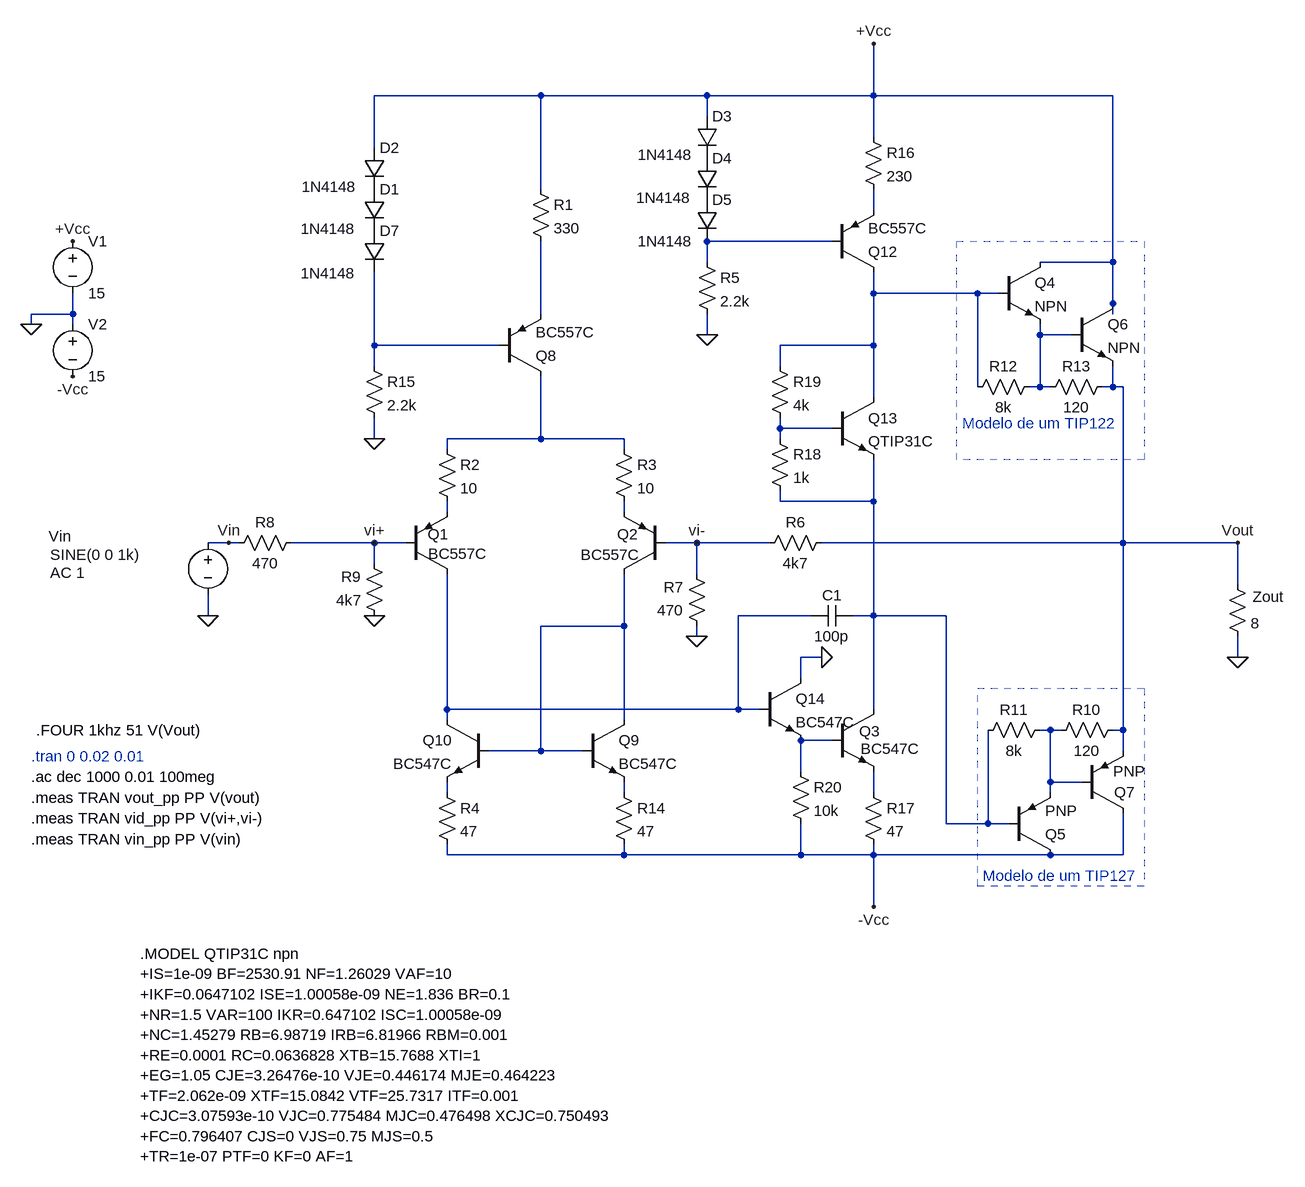
[diagram p0: schematic Amp_v2.asc]
Amp_v2.asc, the LTspice schematic file:
Version 4.1
SHEET 1 2292 1108
WIRE 112 -528 -144 -528
WIRE 368 -528 112 -528
WIRE 624 -528 624 -608
WIRE 624 -528 368 -528
WIRE 992 -528 624 -528
WIRE 368 -496 368 -528
WIRE 624 -464 624 -528
WIRE -144 -448 -144 -528
WIRE 112 -384 112 -528
WIRE 624 -352 624 -384
WIRE 560 -304 368 -304
WIRE 368 -272 368 -304
WIRE 992 -272 992 -528
WIRE 992 -272 880 -272
WIRE 624 -224 624 -256
WIRE 784 -224 624 -224
WIRE 816 -224 784 -224
WIRE 992 -208 992 -272
WIRE -608 -192 -608 -224
WIRE -608 -192 -672 -192
WIRE 112 -192 112 -304
WIRE 992 -192 992 -208
WIRE -672 -176 -672 -192
WIRE -608 -176 -608 -192
WIRE 368 -160 368 -192
WIRE 880 -160 880 -176
WIRE 928 -160 880 -160
WIRE -144 -144 -144 -256
WIRE 48 -144 -144 -144
WIRE 624 -144 624 -224
WIRE 624 -144 480 -144
WIRE -144 -112 -144 -144
WIRE 480 -112 480 -144
WIRE 784 -80 784 -224
WIRE 880 -80 880 -160
WIRE 880 -80 864 -80
WIRE 896 -80 880 -80
WIRE 992 -80 992 -112
WIRE 992 -80 976 -80
WIRE 1008 -80 992 -80
WIRE 624 -64 624 -144
WIRE 480 -16 480 -32
WIRE 560 -16 480 -16
WIRE -144 0 -144 -32
WIRE 112 0 112 -96
WIRE 112 0 -32 0
WIRE 240 0 112 0
WIRE 480 0 480 -16
WIRE -32 16 -32 0
WIRE 240 16 240 0
WIRE 480 96 480 80
WIRE 624 96 624 32
WIRE 624 96 480 96
WIRE -32 112 -32 96
WIRE 240 112 240 96
WIRE -368 160 -400 160
WIRE -352 160 -368 160
WIRE -144 160 -272 160
WIRE -96 160 -144 160
WIRE 352 160 304 160
WIRE 464 160 352 160
WIRE 1008 160 1008 -80
WIRE 1008 160 544 160
WIRE 1184 160 1008 160
WIRE -144 192 -144 160
WIRE 352 208 352 160
WIRE 1184 224 1184 160
WIRE -400 272 -400 240
WIRE 528 272 416 272
WIRE 624 272 624 96
WIRE 624 272 592 272
WIRE 736 272 624 272
WIRE 240 288 240 208
WIRE 240 288 112 288
WIRE 352 304 352 288
WIRE 544 336 512 336
WIRE 1184 336 1184 304
WIRE 512 368 512 336
WIRE -32 416 -32 208
WIRE 416 416 416 272
WIRE 416 416 -32 416
WIRE 448 416 416 416
WIRE 624 416 624 272
WIRE -32 432 -32 416
WIRE 240 432 240 288
WIRE 896 448 880 448
WIRE 912 448 896 448
WIRE 1008 448 1008 160
WIRE 1008 448 992 448
WIRE 560 464 512 464
WIRE 112 480 112 288
WIRE 112 480 32 480
WIRE 176 480 112 480
WIRE 1008 480 1008 448
WIRE 512 512 512 464
WIRE 896 528 896 448
WIRE 944 528 896 528
WIRE -32 544 -32 528
WIRE 240 544 240 528
WIRE 624 544 624 512
WIRE 896 544 896 528
WIRE 736 592 736 272
WIRE 800 592 800 448
WIRE 800 592 736 592
WIRE 832 592 800 592
WIRE -32 640 -32 624
WIRE 240 640 240 624
WIRE 240 640 -32 640
WIRE 512 640 512 592
WIRE 512 640 240 640
WIRE 624 640 624 624
WIRE 624 640 512 640
WIRE 896 640 624 640
WIRE 1008 640 1008 576
WIRE 1008 640 896 640
WIRE 624 720 624 640
FLAG -400 272 0
FLAG -672 -176 0
FLAG -608 -304 +Vcc
FLAG 624 -608 +Vcc
FLAG -608 -96 -Vcc
FLAG 624 720 -Vcc
FLAG -144 272 0
FLAG 1184 160 Vout
FLAG 1184 336 0
FLAG -144 0 0
FLAG 368 -160 0
FLAG 544 336 0
FLAG -144 160 vi+
FLAG 352 160 vi-
FLAG -368 160 Vin
FLAG 352 304 0
SYMBOL voltage -608 -320 R0
WINDOW 123 24 44 Left 2
WINDOW 39 0 0 Left 0
SYMATTR InstName V1
SYMATTR Value 15
SYMBOL voltage -608 -192 R0
WINDOW 123 0 0 Left 0
WINDOW 39 0 0 Left 0
SYMATTR InstName V2
SYMATTR Value 15
SYMBOL voltage -400 144 R0
WINDOW 123 -243 62 Left 2
WINDOW 39 24 152 Left 0
WINDOW 0 -245 6 Left 2
WINDOW 3 -243 34 Left 2
SYMATTR Value2 AC 1
SYMATTR InstName Vin
SYMATTR Value SINE(0 0 1k)
SYMBOL res -48 0 R0
SYMATTR InstName R2
SYMATTR Value 10
SYMBOL res 224 0 R0
SYMATTR InstName R3
SYMATTR Value 10
SYMBOL res 560 144 R90
WINDOW 0 0 56 VBottom 2
WINDOW 3 32 56 VTop 2
SYMATTR InstName R6
SYMATTR Value 4k7
SYMBOL res 368 304 R180
WINDOW 0 36 76 Left 2
WINDOW 3 36 40 Left 2
SYMATTR InstName R7
SYMATTR Value 470
SYMBOL res 1008 432 R90
WINDOW 0 0 56 VBottom 2
WINDOW 3 32 56 VTop 2
SYMATTR InstName R10
SYMATTR Value 120
SYMBOL res 896 432 R90
WINDOW 0 0 56 VBottom 2
WINDOW 3 32 56 VTop 2
SYMATTR InstName R11
SYMATTR Value 8k
SYMBOL res 880 -96 R90
WINDOW 0 0 56 VBottom 2
WINDOW 3 32 56 VTop 2
SYMATTR InstName R12
SYMATTR Value 8k
SYMBOL res 992 -96 R90
WINDOW 0 0 56 VBottom 2
WINDOW 3 32 56 VTop 2
SYMATTR InstName R13
SYMATTR Value 120
SYMBOL cap 592 256 R90
WINDOW 0 0 32 VBottom 2
WINDOW 3 32 32 VTop 2
SYMATTR InstName C1
SYMATTR Value 100p
SYMBOL npn 560 416 R0
WINDOW 0 42 34 Left 2
WINDOW 3 44 61 Left 2
SYMATTR InstName Q3
SYMATTR Value BC547C
SYMBOL npn 816 -272 R0
SYMATTR InstName Q4
SYMBOL pnp 832 640 M180
SYMATTR InstName Q5
SYMBOL npn 928 -208 R0
SYMATTR InstName Q6
SYMBOL pnp 944 576 M180
WINDOW 0 50 32 Left 2
WINDOW 3 49 65 Left 2
SYMATTR InstName Q7
SYMBOL pnp -96 208 M180
WINDOW 0 34 61 Left 2
WINDOW 3 35 31 Left 2
SYMATTR InstName Q1
SYMATTR Value BC557C
SYMBOL pnp 304 208 R180
WINDOW 0 42 61 Left 2
WINDOW 3 40 30 Left 2
SYMATTR InstName Q2
SYMATTR Value BC557C
SYMBOL res -256 144 R90
WINDOW 0 0 56 VBottom 2
WINDOW 3 32 56 VTop 2
SYMATTR InstName R8
SYMATTR Value 470
SYMBOL res -128 288 R180
WINDOW 0 36 76 Left 2
WINDOW 3 36 40 Left 2
SYMATTR InstName R9
SYMATTR Value 4k7
SYMBOL res 1168 208 R0
WINDOW 0 39 35 Left 2
SYMATTR InstName Zout
SYMATTR Value 8
SYMBOL res -160 -128 R0
SYMATTR InstName R15
SYMATTR Value 2.2k
SYMBOL res 96 -400 R0
SYMATTR InstName R1
SYMATTR Value 330
SYMBOL pnp 48 -96 M180
SYMATTR InstName Q8
SYMATTR Value BC557C
SYMBOL diode -160 -320 R0
WINDOW 3 -97 65 Left 2
SYMATTR Value 1N4148
SYMATTR InstName D7
SYMBOL npn 176 432 R0
SYMATTR InstName Q9
SYMATTR Value BC547C
SYMBOL npn 32 432 M0
SYMATTR InstName Q10
SYMATTR Value BC547C
SYMBOL res -48 528 R0
SYMATTR InstName R4
SYMATTR Value 47
SYMBOL res 224 528 R0
SYMATTR InstName R14
SYMATTR Value 47
SYMBOL res 352 -288 R0
SYMATTR InstName R5
SYMATTR Value 2.2k
SYMBOL res 608 -480 R0
SYMATTR InstName R16
SYMATTR Value 230
SYMBOL pnp 560 -256 M180
SYMATTR InstName Q12
SYMATTR Value BC557C
SYMBOL res 608 528 R0
SYMATTR InstName R17
SYMATTR Value 47
SYMBOL npn 560 -64 R0
SYMATTR InstName Q13
SYMATTR Value QTIP31C
SYMBOL res 464 -16 R0
SYMATTR InstName R18
SYMATTR Value 1k
SYMBOL res 464 -128 R0
SYMATTR InstName R19
SYMATTR Value 4k
SYMBOL npn 448 368 R0
SYMATTR InstName Q14
SYMATTR Value BC547C
SYMBOL res 496 496 R0
SYMATTR InstName R20
SYMATTR Value 10k
SYMBOL diode -160 -384 R0
WINDOW 3 -97 61 Left 2
SYMATTR Value 1N4148
SYMATTR InstName D1
SYMBOL diode -160 -448 R0
WINDOW 3 -96 60 Left 2
SYMATTR Value 1N4148
SYMATTR InstName D2
SYMBOL diode 352 -496 R0
WINDOW 3 -91 59 Left 2
SYMATTR Value 1N4148
SYMATTR InstName D3
SYMBOL diode 352 -432 R0
WINDOW 3 -93 61 Left 2
SYMATTR Value 1N4148
SYMATTR InstName D4
SYMBOL diode 352 -368 R0
WINDOW 3 -91 64 Left 2
SYMATTR Value 1N4148
SYMATTR InstName D5
TEXT -672 488 Left 2 ;.tran 0 0.02 0.01
TEXT -664 448 Left 2 !.FOUR 1khz 51 V(Vout)
TEXT 760 -24 Left 2 ;Modelo de um TIP122
TEXT 792 672 Left 2 ;Modelo de um TIP127
TEXT -672 520 Left 2 !.ac dec 1000 0.01 100meg
TEXT -672 552 Left 2 !.meas TRAN vout_pp PP V(vout)
TEXT -672 584 Left 2 !.meas TRAN vid_pp PP V(vi+,vi-)
TEXT -504 792 Left 2 !.MODEL QTIP31C npn\n+IS=1e-09 BF=2530.91 NF=1.26029 VAF=10\n+IKF=0.0647102 ISE=1.00058e-09 NE=1.836 BR=0.1\n+NR=1.5 VAR=100 IKR=0.647102 ISC=1.00058e-09\n+NC=1.45279 RB=6.98719 IRB=6.81966 RBM=0.001\n+RE=0.0001 RC=0.0636828 XTB=15.7688 XTI=1\n+EG=1.05 CJE=3.26476e-10 VJE=0.446174 MJE=0.464223\n+TF=2.062e-09 XTF=15.0842 VTF=25.7317 ITF=0.001\n+CJC=3.07593e-10 VJC=0.775484 MJC=0.476498 XCJC=0.750493\n+FC=0.796407 CJS=0 VJS=0.75 MJS=0.5\n+TR=1e-07 PTF=0 KF=0 AF=1
TEXT -672 616 Left 2 !.meas TRAN vin_pp PP V(vin)
RECTANGLE Normal 1040 32 752 -304 2
RECTANGLE Normal 1040 688 784 384 2

The netlist it stands for:
* Amp_v2.asc
V1 +Vcc 0 15
V2 0 -Vcc 15
Vin Vin 0 SINE(0 0 1k) AC 1
R2 N008 N010 10
R3 N008 N011 10
R6 Vout vi- 4k7
R7 0 vi- 470
R10 Vout N014 120
R11 N014 N009 8k
R12 N005 N003 8k
R13 Vout N005 120
C1 N009 N012 100p
Q3 N009 N015 N018 0 BC547C
Q4 +Vcc N003 N005 0 NPN
Q5 -Vcc N009 N014 0 PNP
Q6 +Vcc N005 Vout 0 NPN
Q7 -Vcc N014 Vout 0 PNP
Q1 N012 vi+ N010 0 BC557C
Q2 N013 vi- N011 0 BC557C
R8 vi+ Vin 470
R9 0 vi+ 4k7
R§Zout Vout 0 8
R15 N006 0 2.2k
R1 +Vcc N004 330
Q8 N008 N006 N004 0 BC557C
D7 P001 N006 1N4148
Q9 N013 N013 N017 0 BC547C
Q10 N012 N013 N016 0 BC547C
R4 N016 -Vcc 47
R14 N017 -Vcc 47
R5 N002 0 2.2k
R16 +Vcc N001 230
Q12 N003 N002 N001 0 BC557C
R17 N018 -Vcc 47
Q13 N003 N007 N009 0 QTIP31C
R18 N007 N009 1k
R19 N003 N007 4k
Q14 0 N012 N015 0 BC547C
R20 N015 -Vcc 10k
D1 P002 P001 1N4148
D2 +Vcc P002 1N4148
D3 +Vcc P003 1N4148
D4 P003 P004 1N4148
D5 P004 N002 1N4148
.model D D
.lib standard.dio
.model NPN NPN
.model PNP PNP
.lib standard.bjt
* .tran 0 0.02 0.01
.FOUR 1khz 51 V(Vout)
* Modelo de um TIP122
* Modelo de um TIP127
.ac dec 1000 0.01 100meg
.meas TRAN vout_pp PP V(vout)
.meas TRAN vid_pp PP V(vi+,vi-)
.MODEL QTIP31C npn
+IS=1e-09 BF=2530.91 NF=1.26029 VAF=10
+IKF=0.0647102 ISE=1.00058e-09 NE=1.836 BR=0.1
+NR=1.5 VAR=100 IKR=0.647102 ISC=1.00058e-09
+NC=1.45279 RB=6.98719 IRB=6.81966 RBM=0.001
+RE=0.0001 RC=0.0636828 XTB=15.7688 XTI=1
+EG=1.05 CJE=3.26476e-10 VJE=0.446174 MJE=0.464223
+TF=2.062e-09 XTF=15.0842 VTF=25.7317 ITF=0.001
+CJC=3.07593e-10 VJC=0.775484 MJC=0.476498 XCJC=0.750493
+FC=0.796407 CJS=0 VJS=0.75 MJS=0.5
+TR=1e-07 PTF=0 KF=0 AF=1
.meas TRAN vin_pp PP V(vin)
.backanno
.end